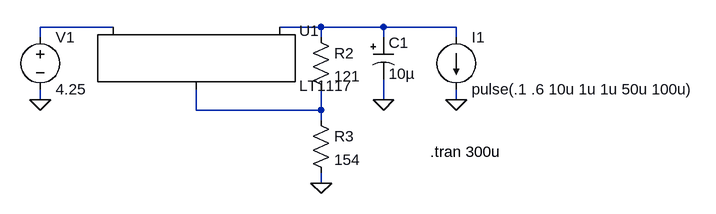
[diagram p0: schematic LT1117.asc]
LT1117.asc, the LTspice schematic file:
Version 4
SHEET 1 1108 680
WIRE 96 176 -16 176
WIRE 416 176 352 176
WIRE 512 176 416 176
WIRE 624 176 512 176
WIRE -16 192 -16 176
WIRE 416 192 416 176
WIRE 512 192 512 176
WIRE 624 192 624 176
WIRE -16 288 -16 272
WIRE 512 288 512 256
WIRE 624 288 624 272
WIRE 224 304 224 272
WIRE 416 304 416 272
WIRE 416 304 224 304
WIRE 416 320 416 304
WIRE 416 416 416 400
FLAG -16 288 0
FLAG 512 288 0
FLAG 624 288 0
FLAG 416 416 0
SYMBOL PowerProducts\\LT1117 224 176 R0
SYMATTR InstName U1
SYMBOL polcap 496 192 R0
WINDOW 3 24 56 Left 2
SYMATTR Value 10µ
SYMATTR InstName C1
SYMATTR Description Capacitor
SYMATTR Type cap
SYMATTR SpiceLine V=33 Irms=0 Rser=0.3 Lser=0 mfg="KEMET" pn="T495D106M035AS" type="Tantalum"
SYMBOL voltage -16 176 R0
SYMATTR InstName V1
SYMATTR Value 4.25
SYMBOL res 400 176 R0
SYMATTR InstName R2
SYMATTR Value 121
SYMBOL res 400 304 R0
SYMATTR InstName R3
SYMATTR Value 154
SYMBOL current 624 192 R0
SYMATTR InstName I1
SYMATTR Value pulse(.1 .6 10u 1u 1u 50u 100u)
TEXT 584 368 Left 2 !.tran 300u

The netlist it stands for:
* LT1117.asc
XU1 N003 N002 N001 LT1117
C1 N002 0 10µ V=33 Irms=0 Rser=0.3 Lser=0 mfg="KEMET" pn="T495D106M035AS" type="Tantalum"
V1 N001 0 4.25
R2 N002 N003 121
R3 N003 0 154
I1 N002 0 pulse(.1 .6 10u 1u 1u 50u 100u)
.tran 300u
.lib LT1117.lib
.backanno
.end